# EAGLE design ptn-piston_eagle7x (EAGLE 7.7.0)
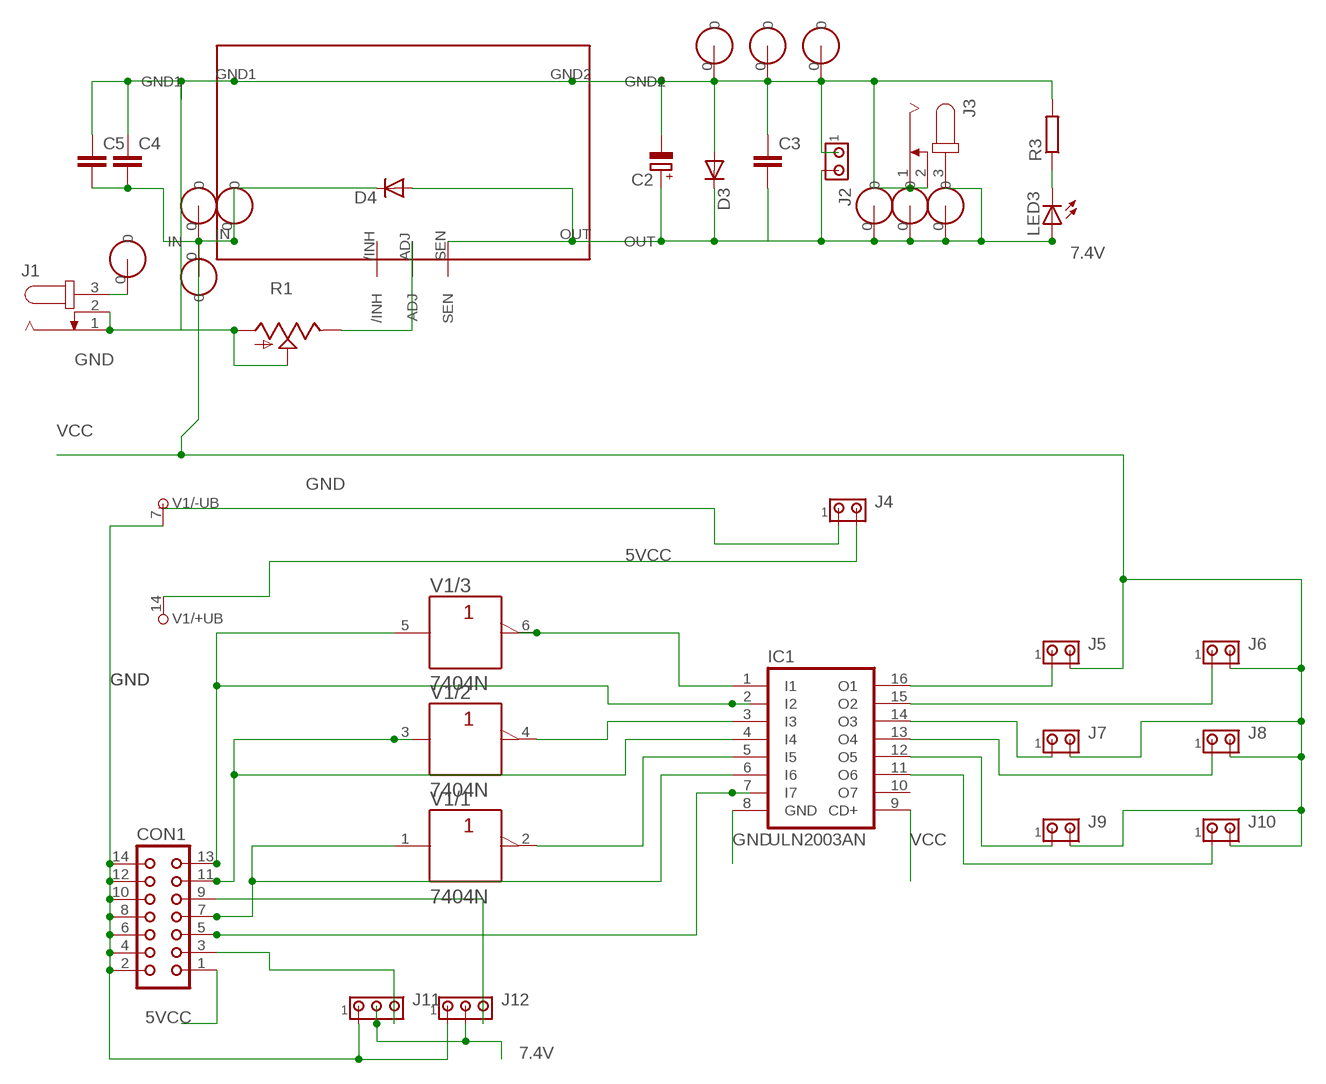
[diagram p0: schematic, sheet 1]

## Parts
C2  CPOL-EUE3.5-8  [E3,5-8]
C3  C-EUC1206K  [C1206K]
C4  C-EUC1206K  [C1206K]
C5  C-EUC1206K  [C1206K]
CON1  CON14  [CON14]
D3  DIODE-SMB  [SMB]
D4  DIODE-SMB  [SMB]
IC1  ULN2003AN  [DIL16]
J1  JACK-PLUG1  [SPC4078]
J2  MTA02-100  [10X02MTA]
J3  JACK-PLUG1  [SPC4078]
J4  MTA02-100  [10X02MTA]
J5  MTA02-100  [10X02MTA]
J6  MTA02-100  [10X02MTA]
J7  MTA02-100  [10X02MTA]
J8  MTA02-100  [10X02MTA]
J9  MTA02-100  [10X02MTA]
J10  MTA02-100  [10X02MTA]
J11  MTA03-100  [10X03MTA]
J12  MTA03-100  [10X03MTA]
LED3  LED3MM  [LED3MM]
R1  TRIM_US-B64Y  [B64Y]
R3  R-EU_R0603  [R0603]
U$1  PTNPTN2  [PTN]
U$2  PAD0  [SWITCHPAD]
U$3  PADSWITCHPAD1  [SWITCHPAD]
U$4  PADSWITCHPAD1  [SWITCHPAD]
U$5  PADSWITCHPAD1  [SWITCHPAD]
U$6  PADSWITCHPAD1  [SWITCHPAD]
U$7  PADSWITCHPAD1  [SWITCHPAD]
U$8  PADSWITCHPAD1  [SWITCHPAD]
U$9  PADSWITCHPAD1  [SWITCHPAD]
U$10  PADSWITCHPAD1  [SWITCHPAD]
U$11  PADSWITCHPAD1  [SWITCHPAD]
V1  7404N  [DIL14]

## Nets
5VCC: CON1.1 J4.2 V1.14(/+UB:+UB)
7.4V: C2.+ C3.2 D3.C D4.A J2.2 J3.3 J11.2 J12.2 LED3.A U$1.OUT U$1.SEN U$5.0 U$7.0 U$9.0
GND: C2.- C3.1 C4.1 C5.1 CON1.2 CON1.4 CON1.6 CON1.8 CON1.10 CON1.12 CON1.14 D3.A IC1.8(GND) J1.1 J1.2 J2.1 J3.1 J3.2 J4.1 J11.1 J12.1 R1.A R1.S R3.2 U$1.GND1 U$1.GND2 U$4.0 U$6.0 U$8.0 V1.7(/-UB:-UB)
N$3: CON1.13 IC1.2(I2) V1.5(/3:A)
N$4: LED3.K(C) R3.1
N$5: R1.E U$1.ADJ
N$6: CON1.11 IC1.4(I4) V1.3(/2:A)
N$7: J1.3 U$3.0
N$8: CON1.7 IC1.6(I6) V1.1(/1:A)
N$10: IC1.5(I5) V1.2(/1:Y)
N$11: CON1.5 IC1.7(I7)
N$12: IC1.1(I1) V1.6(/3:Y)
N$13: IC1.3(I3) V1.4(/2:Y)
N$14: CON1.3 J11.3
N$16: CON1.9 J12.3
N$17: IC1.16(O1) J5.1
N$18: IC1.15(O2) J6.1
N$19: IC1.14(O3) J7.1
N$20: IC1.13(O4) J8.1
N$21: IC1.12(O5) J9.1
N$22: IC1.11(O6) J10.1
VCC: C4.2 C5.2 D4.C IC1.9(CD+) J5.2 J6.2 J7.2 J8.2 J9.2 J10.2 U$1.IN U$2.0 U$10.0 U$11.0
Unconnected: IC1.10(O7) U$1./INH V1.8(/4:Y) V1.9(/4:A) V1.10(/5:Y) V1.11(/5:A) V1.12(/6:Y) V1.13(/6:A)

## Library data of the parts
C2 = rcl:CPOL-EU: POLARIZED CAPACITOR, European symbol
C3-C5 = rcl:C-EU: CAPACITOR, European symbol
CON1 = con-harting:CON14: CONNECTOR
D3 D4 = diode:DIODE-: DIODE
IC1 = uln-udn:ULN2003A: DRIVER ARRAY
J1 J3 = con-jack:JACK-PLUG: DC POWER JACK Power Jack, DC, Right Angle, Through Hole, Rated 5A at 16VDC, PC Terminals Distributor: Farnell (www.Farnell.de) Drawing: 84N1161.pdf / 84N1162.pdf Manufacturer: SPC Technology (www.spctechnology.com) Type: SPC4077 / SPC 4078
J2 J4-J10 = con-amp:MTA02-100: AMP connector
J11 J12 = con-amp:MTA03-100: AMP connector
LED3 = led:LED: LED OSRAM: - CHIPLED LG R971, LG N971, LY N971, LG Q971, LY Q971, LO R971, LY R971 LH N974, LH R974 LS Q976, LO Q976, LY Q976 LO Q996 - Hyper CHIPLED LW Q18S LB Q993, LB Q99A, LB R99A - SideLED LS A670, LO A670, LY A670, LG A670, LP A670 LB A673, LV A673, LT A673, LW A673 LH A674 LY A675 LS A676, LA A676, LO A676, LY A676, LW A676 LS A679, LY A679, LG A679 - Hyper Micro SIDELED® LS Y876, LA Y876, LO Y876, LY Y876 LT Y87S - SmartLED LW L88C, LW L88S LB L89C, LB L89S, LG L890 LS L89K, LO L89K, LY L89K LS L896, LA L896, LO L896, LY L896 - TOPLED LS T670, LO T670, LY T670, LG T670, LP T670 LSG T670, LSP T670, LSY T670, LOP T670, LYG T670 LG T671, LOG T671, LSG T671 LB T673, LV T673, LT T673, LW T673 LH T674 LS T676, LA T676, LO T676, LY T676, LB T676, LH T676, LSB T676, LW T676 LB T67C, LV T67C, LT T67C, LS T67K, LO T67K, LY T67K, LW E67C LS E67B, LA E67B, LO E67B, LY E67B, LB E67C, LV E67C, LT E67C LW T67C LS T679, LY T679, LG T679 LS T770, LO T770, LY T770, LG T770, LP T770 LB T773, LV T773, LT T773, LW T773 LH T774 LS E675, LA E675, LY E675, LS T675 LS T776, LA T776, LO T776, LY T776, LB T776 LHGB T686 LT T68C, LB T68C - Hyper Mini TOPLED® LB M676 - Mini TOPLED Santana® LG M470 LS M47K, LO M47K, LY M47K Source: http://www.osram.convergy.de LUXEON: - LUMILED® LXK2-PW12-R00, LXK2-PW12-S00, LXK2-PW14-U00, LXK2-PW14-V00 LXK2-PM12-R00, LXK2-PM12-S00, LXK2-PM14-U00 LXK2-PE12-Q00, LXK2-PE12-R00, LXK2-PE12-S00, LXK2-PE14-T00, LXK2-PE14-U00 LXK2-PB12-K00, LXK2-PB12-L00, LXK2-PB12-M00, LXK2-PB14-N00, LXK2-PB14-P00, LXK2-PB14-Q00 LXK2-PR12-L00, LXK2-PR12-M00, LXK2-PR14-Q00, LXK2-PR14-R00 LXK2-PD12-Q00, LXK2-PD12-R00, LXK2-PD12-S00 LXK2-PH12-R00, LXK2-PH12-S00 LXK2-PL12-P00, LXK2-PL12-Q00, LXK2-PL12-R00 Source: www.luxeon.com KINGBRIGHT: KA-3528ASYC Source: www.kingbright.com
R1 = pot:TRIM_US-: POTENTIOMETER
R3 = rcl:R-EU_: RESISTOR, European symbol
U$1 = ptn78020_2:PTN
U$2-U$11 = switchpad:PAD
V1 = 74ttl-din:74*04: Hex INVERTER

## Board
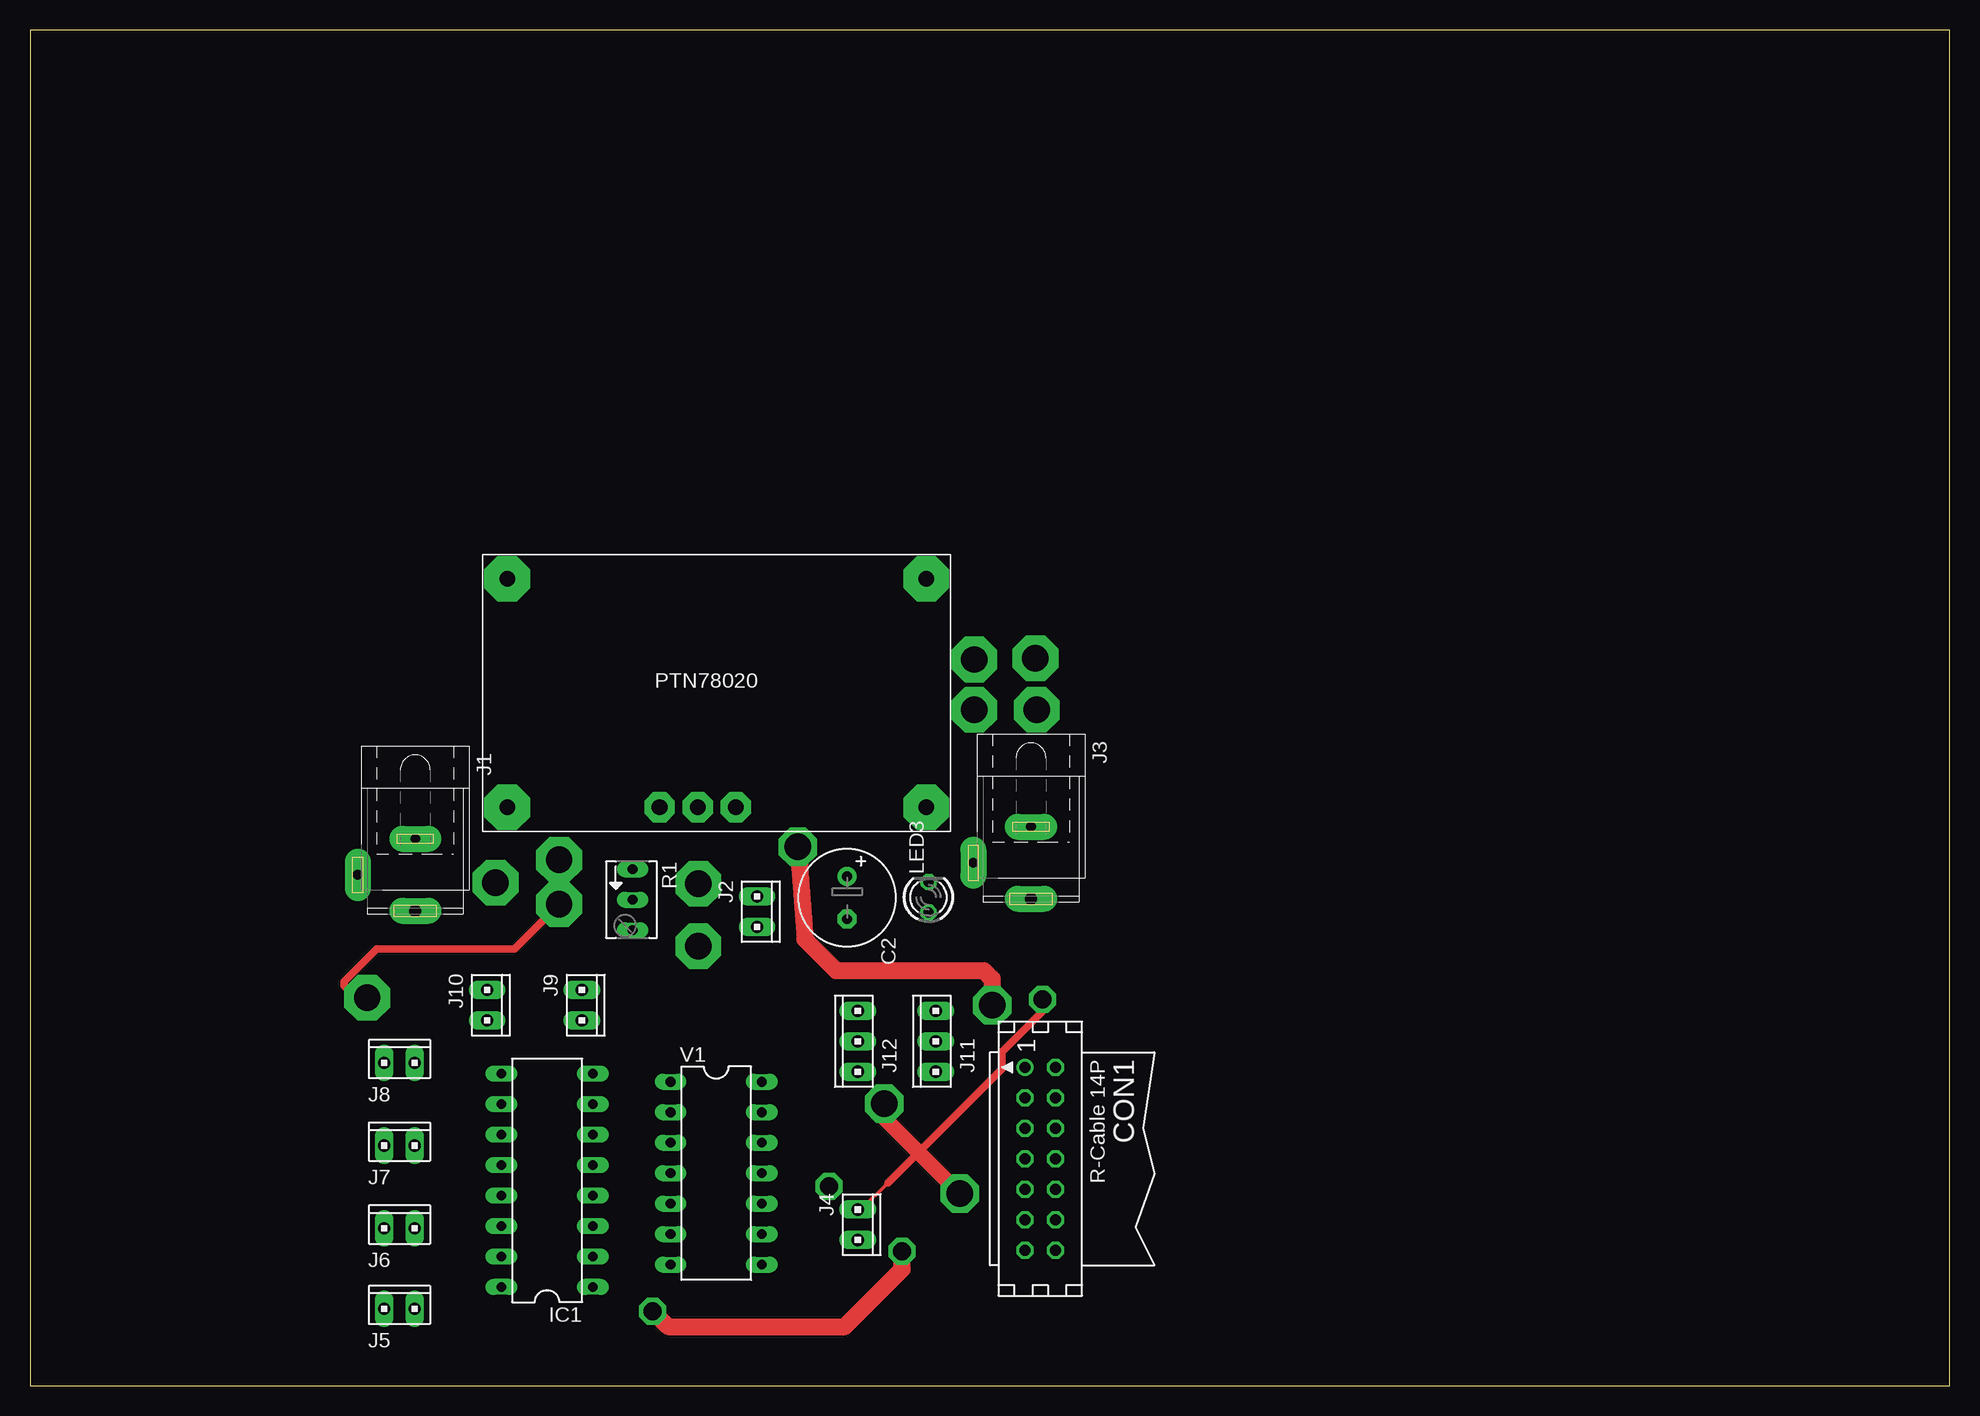
[diagram p1: board, top side]
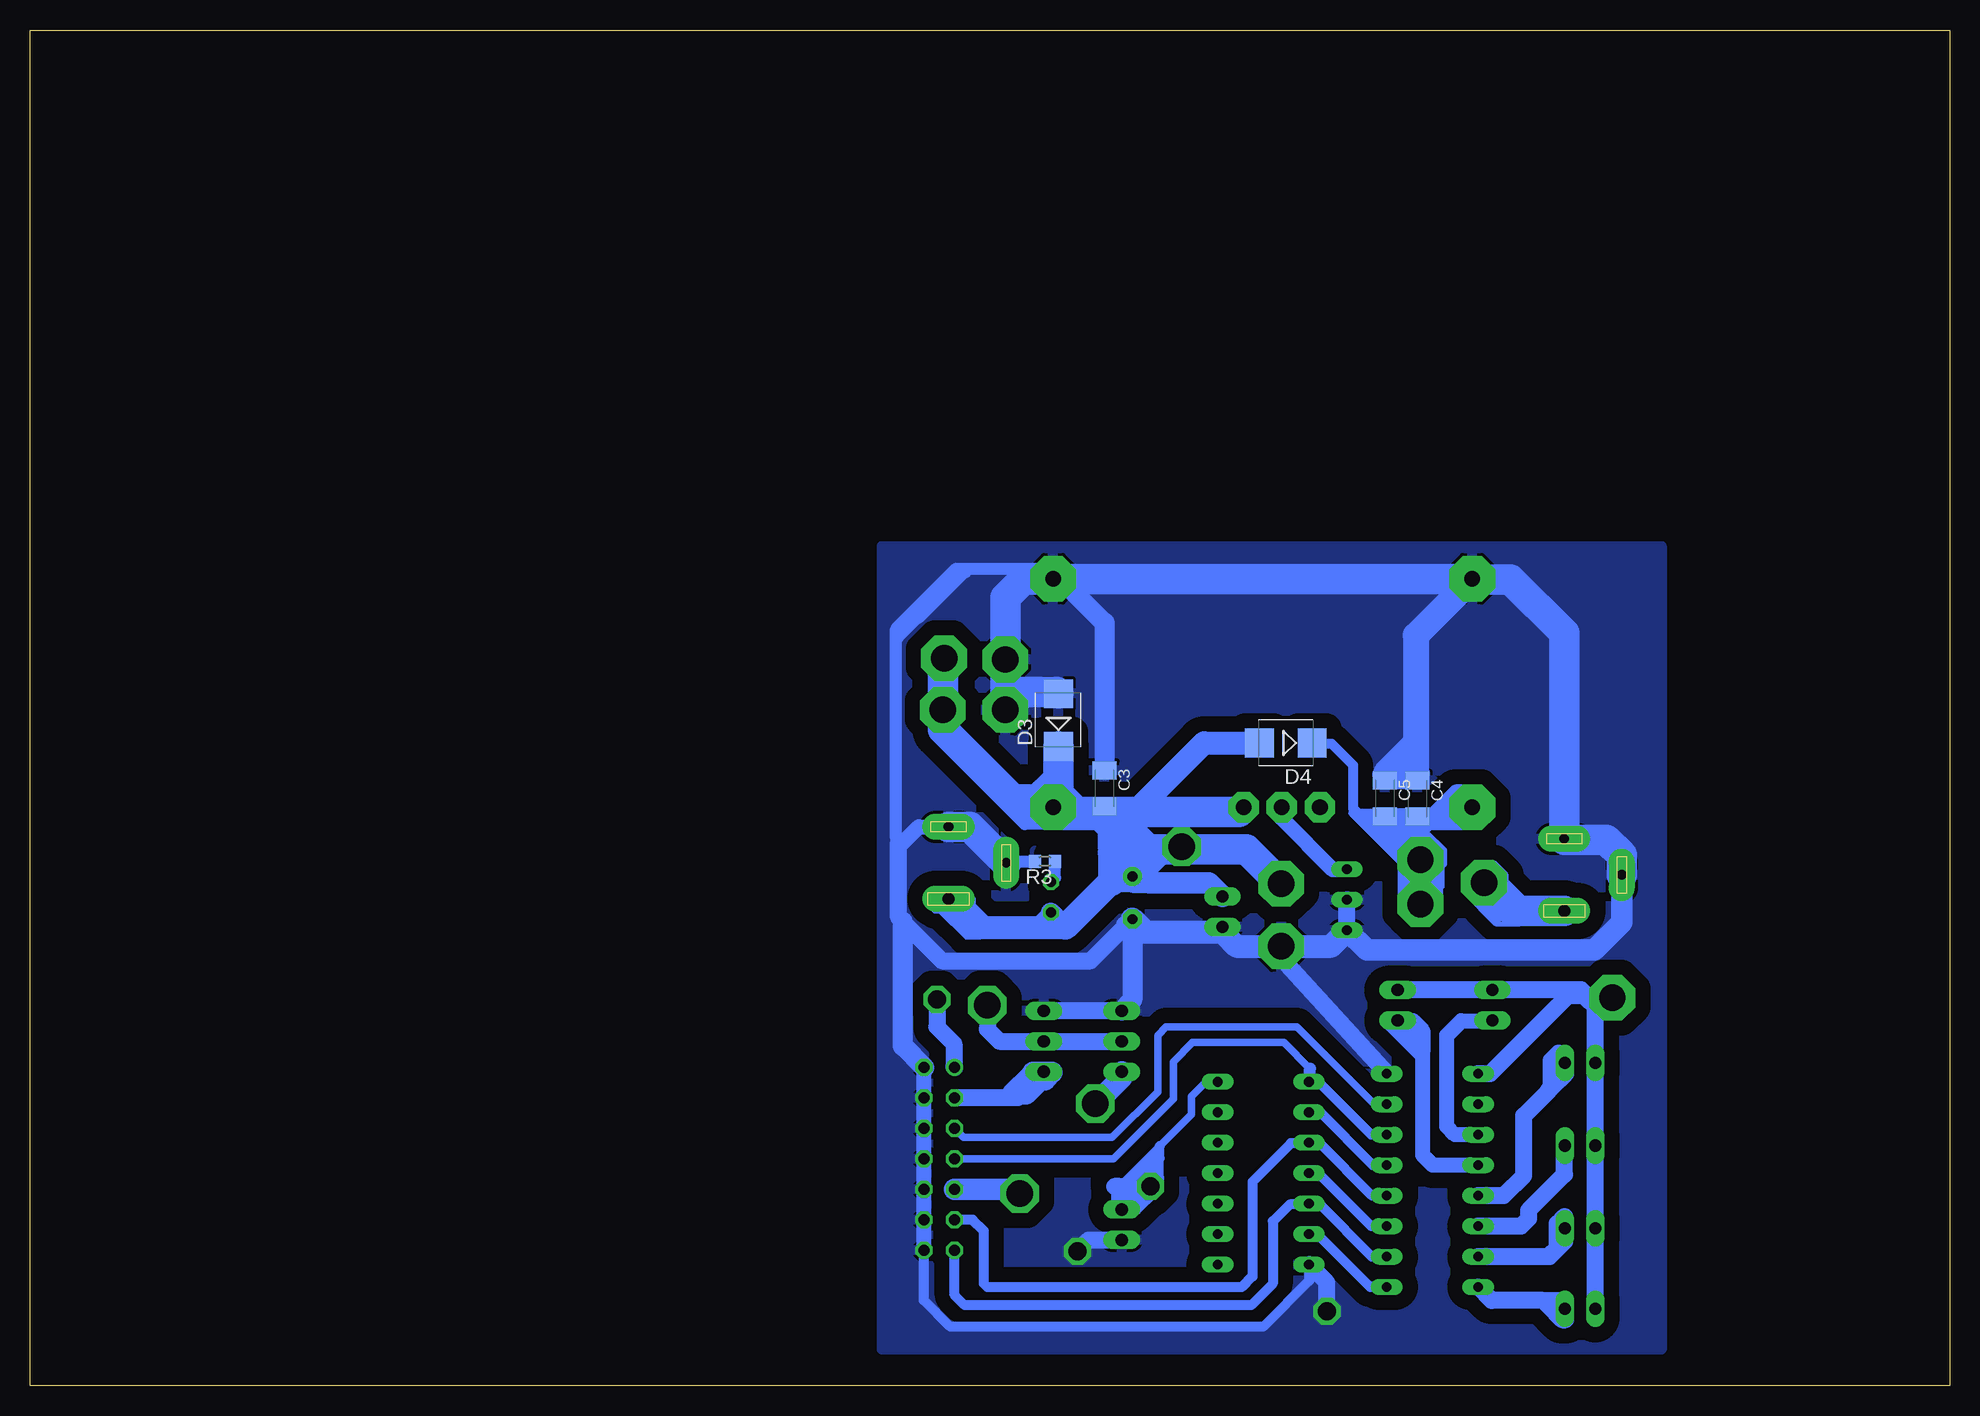
[diagram p2: board, bottom side, seen from below]

Size 160 x 113 mm. Coordinates in mm from the lower left corner, seen from the top.
Outline: 0,0 160,0 160,113 0,113 0,0
Copper layers (1*16): Top 0.035mm / dielectric 1.5mm / Bottom 0.035mm
Design rules "default *": minimum track width 10mil, minimum drill 24mil, track to track 50mil, track to pad 50mil, pad to pad 50mil, via to via 50mil, smd to smd 8mil, copper to edge 40mil, drill to drill 8mil, minimum pad ring 10mil, minimum via ring 8mil, stop-mask expansion 4mil, vias tented up to drill 0mil, thermal gap 10mil

### Footprints (pad centres in the part's own frame; a part is rotated, then mirrored left to right if it is on the bottom)
E3,5-8 = drill 0.813 pad 1.6: + -1.778,0 | drill 0.813 pad 1.6 octagon: - 1.778,0
C1206K = smd 1.5 x 2: 1 -1.5,0; 2 1.5,0
CON14 = drill 0.914: 1 -7.62,-1.27 | drill 0.914 octagon: 2 -7.62,1.27; 3 -5.08,-1.27; 4 -5.08,1.27; 5 -2.54,-1.27; 6 -2.54,1.27; 7 0,-1.27; 8 0,1.27; 9 2.54,-1.27; 10 2.54,1.27; 11 5.08,-1.27; 12 5.08,1.27; 13 7.62,-1.27; 14 7.62,1.27
SMB = smd 2.4 x 2.4: A 2.2,0; C -2.2,0
DIL16 = drill 0.813 long: 1 -8.89,-3.81; 2 -6.35,-3.81; 3 -3.81,-3.81; 4 -1.27,-3.81; 5 1.27,-3.81; 6 3.81,-3.81; 7 6.35,-3.81; 8 8.89,-3.81; 9 8.89,3.81; 10 6.35,3.81; 11 3.81,3.81; 12 1.27,3.81; 13 -1.27,3.81; 14 -3.81,3.81; 15 -6.35,3.81; 16 -8.89,3.81
SPC4078 = drill 0.8 pad 2.184 long: 1 -3,0; 2 0,-4.8 | drill 1 pad 2.184 long: 3 3,0
10X02MTA = drill 1.016 long: 1 1.27,0; 2 -1.27,0
10X03MTA = drill 1.016 long: 1 2.54,0; 2 0,0; 3 -2.54,0
LED3MM = drill 0.813 octagon: A -1.27,0; K 1.27,0
B64Y = drill 0.813 long: A 2.54,0; E -2.54,0; S 0,0
R0603 = smd 1 x 1.1: 1 -0.85,0; 2 0.85,0
PTN = drill 1.3 pad 2.54 octagon: /INH 14.73,-21.08; ADJ 17.91,-21.08; SEN 21.09,-21.08 | drill 1.3 pad 3.81 octagon: GND1 2.03,-2.03; GND2 36.96,-2.03; IN 2.03,-21.08; OUT 36.96,-21.08
SWITCHPAD = drill 2.2 pad 3.81 octagon: 0 -0.093,-0.175
DIL14 = drill 0.813 long: 1 -7.62,-3.81; 2 -5.08,-3.81; 3 -2.54,-3.81; 4 0,-3.81; 5 2.54,-3.81; 6 5.08,-3.81; 7 7.62,-3.81; 8 7.62,3.81; 9 5.08,3.81; 10 2.54,3.81; 11 0,3.81; 12 -2.54,3.81; 13 -5.08,3.81; 14 -7.62,3.81

### Placement (x,y rotation side)
C2  68.11,40.66 270 top
C3  70.43,49.79 270 bottom
C4  44.34,48.93 270 bottom
C5  47.06,48.96 270 bottom
CON1  84.2,18.9 270 top
D3  74.28,55.47 90 bottom
D4  55.33,53.57 180 bottom
IC1  43.1,17.1 90 top
J1  32.12,42.57 270 top
J2  60.6,39.5 270 top
J3  83.44,43.57 270 top
J4  69,13.4 270 top
J5  30.8,6.4 0 top
J6  30.8,13.1 0 top
J7  30.8,20 0 top
J8  30.8,26.9 0 top
J9  46,31.7 270 top
J10  38.1,31.7 270 top
J11  75.5,28.7 90 top
J12  69,28.7 90 top
LED3  74.9,40.7 90 top
R1  50.23,40.49 270 top
R3  75.4,43.7 180 bottom
U$1  37.75,69.28 0 top
U$2  44.2,44 0 top
U$3  38.9,42.1 0 top
U$4  55.8,36.8 0 top
U$5  55.8,42 0 top
U$6  78.8,56.5 0 top
U$7  84,56.5 0 top
U$8  78.8,60.7 0 top
U$9  83.9,60.8 0 top
U$10  44.2,40.3 0 top
U$11  28.2,32.5 0 top
V1  57.2,17.7 270 top

### Tracks (layer width: path | path; a pad name or v marks a point on that pad's centre or on a via)
5VCC  (via drill 1.5 pad 1.42)
  Top 0.305: 71.5,16.9 69.27,14.67 J4.2
  Top 0.61: 71.5,16.9 81,26.4 81,27.8 84.8,31.6 84.8,31.8 v84.4,32.2
  Bottom 0.61: V1.14 61.09,25.4 61.9,25.4 63.2,24.1 63.2,22.6 65.85,19.95 69.2,16.6 | CON1.1 82.8,26.65
  Bottom 0.813: 66.6,18.2 65.85,18.95 65.85,19.95
  Bottom 1.27: 66.5,16.9 66.1,17.3 66.1,18.9 66.6,18.4 66.6,18.2
  Bottom 1.422: v84.4,32.2 84.4,29.9 83,28.5 83,26.59 CON1.1 | 69.2,16.6 69.6,16.6 | 69.2,16.6 v66.6,16.6 | 69.2,16.6 69.2,14.87 J4.2
  Bottom 1.676: v66.6,16.6 67.3,17.3 67.3,17.7 | 66.5,16.9 66.5,16.5 68.1,14.9 69.1,14.9 68.1,15.9 68.1,16
7.4V  (via drill 2.2 pad 1.27, 2.2 pad 2.54)
  Top 1.422: v80.2,31.7 80.2,33.9 79.5,34.6 67.2,34.6 64.6,37.2 v64,44.9
  Bottom 0.254: 71.5,47.7 71.7,47.7 71.7,47.8
  Bottom 0.305: 80.8,37.3 82,37.3 84.2,39.5 84.6,39.5 85,39.9 85,40.2 84.6,39.8 84.2,39.8 82,37.6 82,37.5 84.8,40.3 84.9,40.3 84.5,40.7 84.5,40.3 83.6,41.2 83.44,41.2 | 83.44,41.2 81.9,41.2 81.3,40.6 81.3,40.1 | 81.3,40.1 80.2,39 | 81.3,40.1 82,40.8 82,40.9 82.1,41 82.2,41 81.8,40.6 81.5,40.6 81.7,40.8 81.8,40.8 | J3.3 83.44,41.2
  Bottom 0.61: 69.9,47.8 70.13,48.03 C3.2
  Bottom 1.016: 74.6,46.9 74.5,47 | 74.6,46.9 74.7,46.8 77.1,46.8 78.6,48.3 77.3,49.6 | 77.3,49.6 77.9,49.6 | 77.3,49.6 73.5,49.6 72,48.1 71.1,48.1 71.5,47.7 71.5,46.9 74.6,46.9 | 74.6,46.9 74.5,46.8 71.3,46.8 75,50.5 75,50.9 76.6,49.3 76.6,49.1
  Bottom 1.27: 68.11,41.91 68.11,42.39 68.1,42.4
  Bottom 1.422: J12.2 J11.2 79.2,28.7 80.2,29.7 v80.2,31.7 | LED3.A 74.9,39.4 | 74.9,39.4 74.9,38.7 74.1,37.9 80.76,37.9 81.38,38.52 | 82,38.4 75.9,38.4 74.9,39.4 | 64.6,44.7 v64,44.9
  Bottom 1.676: 66.7,41.9 68.1,41.9 68.11,41.91 C2.+ | 73.7,38.23 LED3.A
  Bottom 1.778: 66.7,41.9 61.73,41.9 J2.2
  Bottom 1.93: D4.A 62.13,53.57 68.9,46.8
  Bottom 2.184: C2.+ 68.11,43.11 69.9,44.9 | 69.9,44.9 69.9,44.4 | 69.9,44.4 69.9,42 69.8,41.9 69.8,44.3 69.9,44.4 | 69.9,44.9 69.9,46.4 71.3,47.8 | 69.2,42.4 69.53,42.4 73.7,38.23 | J3.3 81.38,38.52 81.09,38.23
  Bottom 2.54: U$1.OUT 74.31,47.8 71.7,47.8 71.3,47.8 70.3,47.8 | 70.3,47.8 69.9,47.8 59.24,47.8 U$1.SEN | 70.3,47.8 68.11,45.61 | U$5.0 55.73,41.83 58.6,44.7 64.6,44.7 65.85,44.7 | 65.85,44.7 C2.+ | 65.85,44.7 66.8,44.7 68.9,46.8 | 68.1,42.4 69.2,42.4 | U$1.OUT 74.28,48.62 D3.C | U$1.OUT 77.4,48.2 83.91,54.71 U$7.0 83.91,60.62 U$9.0
GND  (via drill 1.5 pad 1.42)
  Top 1.422: v72.7,11.2 72.7,9.7 67.9,4.9 53.2,4.9 v51.9,6.2
  Bottom 0.61: 82,67.8 82.1,67.9 82.1,68.1
  Bottom 0.813: V1.7 53.39,8.71 57.2,4.9 83.3,4.9 85.5,7.1 85.5,11.25 CON1.14 | 84,65.8 85.9,63.9 | 84,65.8 84,65.9 87.6,62.3 87.8,62.3 84.3,65.8 84,65.8 | 84,65.8 82.1,67.7 | 82.1,67.7 81.9,67.9 81.9,68 82,67.9 81.9,67.8 82,67.7 82.1,67.7 | 82.1,67.7 82.1,67.9
  Bottom 1.016: R3.2 78.1,43.7 78.23,43.57 J3.2 | 87.6,45.3 87.6,45.4 87.8,45.6 87.8,62.3 87.8,63.1 82.8,68.1 82.1,68.1 75.7,68.1 74.8,67.2 74.7,67.1
  Bottom 1.27: J3.1 85.93,46.57 87.6,44.9 | CON1.14 CON1.12 CON1.10 CON1.8 CON1.6 CON1.4 CON1.2 | 87.25,38.65 85.47,36.87
  Bottom 1.422: C4.1 44.37,50.46 C5.1 44.54,50.46 44,51 44.5,51 | 44.5,51 47.1,51 47.3,51 47.4,50.9 44.6,50.9 44.5,51 | R1.A R1.S | 60.5,37.7 60.5,38.13 J2.1 60.6,38.2 61,37.8 | C2.- 71.59,35.4 84,35.4 87.25,38.65 87.6,39 87.6,44.9 87.6,45.3 | J12.1 J11.1 | 56.6,36.62 IC1.8 | J4.1 71.77,12.13 v72.7,11.2 | v51.9,6.2 51.9,8.59 V1.7
  Bottom 1.676: C3.1 70.42,63.57 74.1,67.25 | 68.66,38.33 C2.- 68.11,32.13 J12.1 | CON1.2 87.25,28.3 87.25,38.65
  Bottom 1.778: R1.A 48.57,36.3 29.6,36.3 27.32,38.58 J1.2
  Bottom 1.93: 47.1,51 47.1,51.1 44.8,53.4 | R1.A 51.56,36.62 U$4.0 56.6,36.62 59.42,36.62 60.5,37.7 | 61,37.8 67.02,37.8 C2.-
  Bottom 2.184: 44.5,51 44.5,62.53 U$1.GND1
  Bottom 2.54: J1.2 27.32,44.22 28.6,45.5 32.05,45.5 J1.1 32.12,62.72 36.6,67.2 39.73,67.2 U$1.GND1 74.1,67.25 U$1.GND2 74.76,67.2 74.8,67.2 77.2,67.2 78.71,65.69 U$8.0 U$6.0 77.23,57.8 74.41,57.8 D3.A | J3.2 81.64,46.57 J3.1
  pour Bottom: 25,70 24,70 24,3 89,3 89,70
N$3
  Bottom 0.813: CON1.13 82.93,7.53 82.1,6.7 58.2,6.7 56.4,8.5 56.4,13.7 55,15.1 53.45,15.1 V1.5 53.33,15.1 52.5,15.1 48.15,10.75 IC1.2
N$4
  Bottom 1.016: LED3.K 74.55,42.32 R3.1
N$5
  Bottom 1.27: U$1.ADJ 55.66,47.26 51.4,43 50.26,43 R1.E
N$6
  Bottom 0.813: CON1.11 81.42,13.82 80.5,12.9 80.5,8.5 80.2,8.2 59,8.2 58.1,9.1 58.1,17 54.9,20.2 53.43,20.2 V1.3 53.35,20.2 52.5,20.2 48.13,15.83 IC1.4
N$7
  Bottom 0.406: 35.8,38.5 37.8,38.5 40.5,41.2 40.5,41.5 37.8,38.8 37.6,38.8 38.9,40.1 38.9,40.3 39.3,40.7 | 39.3,40.7 39.9,41.3 | 39.3,40.7 35.8,40.7 37,41.9 37,42.6 38,43.6 38.3,43.6 37.2,42.5 37.2,42.2 38.1,43.1 38.3,43.1 38.4,43.2 38.4,43.5 35.3,40.4 35.3,39.6
  Bottom 1.016: 35.3,39.6 35.7,39.6 35.7,39.57
  Bottom 2.54: U$3.0 36.45,39.57 35.7,39.57 J1.3
N$8
  Bottom 0.61: CON1.7 69.7,18.9 64.7,23.9 64.7,27 63.1,28.6 55.5,28.6 53.3,26.4
  Bottom 0.813: IC1.6 48.2,20.9 52.62,25.32 V1.1
  Bottom 1.016: 53.3,26.4 53.3,25.32 V1.1
N$10
  Bottom 0.813: IC1.5 48.07,18.37 52.5,22.8 53.37,22.8 V1.2
N$11
  Bottom 0.61: CON1.5 82.19,20.7 69.8,20.7 66,24.5 66,29.2 65.3,29.9 54.4,29.9 47.95,23.45 IC1.7
N$12
  Bottom 0.813: IC1.1 48.31,8.21 52.7,12.6 53.37,12.6 V1.6
N$13
  Bottom 0.813: IC1.3 48.19,13.29 52.6,17.7 V1.4
N$14
  Bottom 1.27: 76,25.3 75.5,25.8 J11.3
  Bottom 1.422: CON1.3 77.68,23.98 76.2,25.46 76.2,25.5
  Bottom 1.778: 76.2,25.5 75.4,25.5 74.8,26.1 76.4,26.1 76.5,26 76.5,25.9 78.1,24.3 77,24.3 76,25.3
N$16  (via drill 2.2 pad 1.42)
  Top 1.27: v77.5,16 71.2,22.3 v71.2,23.5
  Bottom 1.778: v71.2,23.5 69,25.7 J12.3 | CON1.9 78.56,16.36 arc90 77.8,15.6 77.8,15.7 arc90 v77.5,16
N$17
  Bottom 1.422: IC1.16 38.18,7.1 33.9,7.1 | 33.9,7.1 32.1,7.1 32.1,5.7 32,5.6 32,5.5 32.3,5.5 33.6,6.8 | 33.6,6.8 33.9,7.1 | J5.1 32.47,6.8 33.6,6.8
N$18
  Bottom 1.422: IC1.15 33.35,10.75 32.1,12 32.1,14.1 32.7,13.5 32.7,11.5 | 32.7,11.5 33.4,10.8 | 32.7,11.5 32.3,11.9 32.3,12.87 J6.1
N$19
  Bottom 1.422: IC1.14 35.71,13.29 35.1,13.9 35.1,14.6 32.1,17.6 32.1,19.97 J7.1
N$20
  Bottom 1.422: IC1.13 37.17,15.83 35.5,17.5 35.5,22.5 33.5,24.5 | 33.2,24.8 32,26 32,27.6 32.1,27.7 32.6,27.7 33.2,27.1 33.2,24.8 | 33.5,24.5 33.2,24.8 | 33.5,24.5 J8.1
N$21
  Bottom 1.27: IC1.12 43.07,18.37 43.9,19.2 43.9,27.5 46.8,30.4 44.7,30.4 44.4,30.1 | 44.4,30.1 44.4,28.3 43.9,27.8 43.9,29.6 44.4,30.1 | 44.4,30.1 45,30.1 45.3,29.8 45.37,29.8 J9.1
N$22
  Bottom 1.27: IC1.11 41.21,20.91 41.9,21.6 41.9,29.2 40.7,30.4 38.13,30.4 J10.1
VCC
  Top 0.61: U$10.0 40.38,36.4 28.9,36.4 26.2,33.7 26.2,33.3 27.18,32.33 U$11.0
  Bottom 0.254: 47.9,46 49.5,47.6 49.3,47.6 | 49.3,47.6 48.3,46.6 48.3,46.8 48.5,47 48.3,47 | 49.2,47.6 49.3,47.6
  Bottom 0.406: 43.5,46.7 43.3,46.9 | 43.6,46.6 44.2,46 | 44.2,46 44.2,45.7 | 44.2,46 44.2,46.4 43.8,46 43.8,45.5 | 43.8,45.5 45,46.7 45,46.3 | 42.3,41.6 42.3,43.2 42.6,43.5 44.2,43.5 45.4,42.3 45.4,43.6 45.6,43.8 45.6,43.4 | 45.6,43.4 45.1,42.9 | 45.6,43.4 49.9,47.7 49.9,48.2 49.7,48.2 49.4,47.9 47.2,47.9 47,47.7 44.7,47.7 43.8,46.8 43.7,46.7 | 43.8,45.5 43.5,45.2 43.5,45 43.6,45.1 43.6,46 43.6,46.2 | 43.6,46.6 43.6,46.2 | 43.6,46.6 43.5,46.7 | 43.5,46.7 43.1,46.7 43.6,46.2
  Bottom 0.61: 42.2,43.5 42.2,44.6 43.6,46 | 43.7,46.7 43.6,46.6
  Bottom 0.813: C5.2 49.06,47.46 49.2,47.6 49.7,48.1 49.7,48.2 49.7,51.7 51.5,53.5 53.06,53.5 D4.C
  Bottom 1.016: 43.2,47.6 41.2,49.6 39.4,49.6 40.2,48.8 41.1,48.8 41.7,48.2 41.8,48.2 40.4,46.8 | 40.4,46.8 39.5,46.8 | 43.8,46.8 40.4,46.8
  Bottom 1.422: 46.7,46.9 46.7,47.1 C5.2 44.37,47.46 C4.2 41.73,47.43 41.7,47.4 45.3,47.4 45.6,47.1 41.8,47.1 40.7,48.2 | 40.7,48.2 40.7,47.8 41.4,47.1 40.88,47.1 U$1.IN | 39.9,48.3 40.6,48.3 40.7,48.2 | J9.2 J10.2 38.07,33 30.7,33 29.85,32.15 29.53,31.83 29.53,31.6 | 29.53,31.6 J8.2 J7.2 J6.2 J5.2 | IC1.9 38.31,25.99 31.8,32.5 30.43,32.5 29.53,31.6
  Bottom 1.778: U$11.0 28.28,32.15 29.85,32.15
  Bottom 2.184: 47,46.7 46.9,46.7 46.7,46.9
  Bottom 2.54: 47,46.7 43.71,43.41 U$2.0
  Bottom 3.81: U$10.0 U$2.0